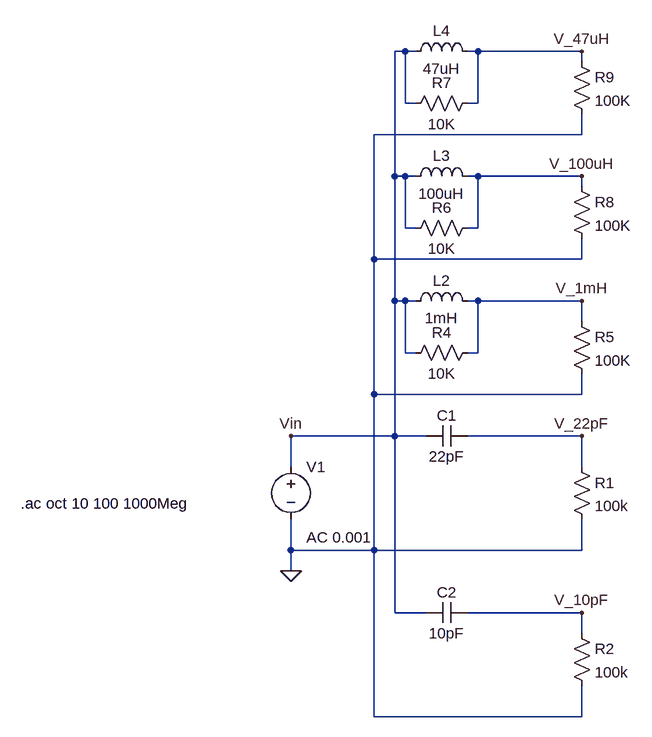
[diagram p0: schematic Filter_003.asc]
Filter_003.asc, the LTspice schematic file:
Version 4
SHEET 1 880 680
WIRE 192 -656 176 -656
WIRE 208 -656 192 -656
WIRE 304 -656 288 -656
WIRE 464 -656 304 -656
WIRE 464 -640 464 -656
WIRE 192 -576 192 -656
WIRE 208 -576 192 -576
WIRE 304 -576 304 -656
WIRE 304 -576 288 -576
WIRE 464 -528 464 -560
WIRE 464 -528 144 -528
WIRE 176 -464 176 -656
WIRE 192 -464 176 -464
WIRE 208 -464 192 -464
WIRE 304 -464 288 -464
WIRE 464 -464 304 -464
WIRE 464 -448 464 -464
WIRE 192 -384 192 -464
WIRE 208 -384 192 -384
WIRE 304 -384 304 -464
WIRE 304 -384 288 -384
WIRE 144 -336 144 -528
WIRE 464 -336 464 -368
WIRE 464 -336 144 -336
WIRE 176 -272 176 -464
WIRE 192 -272 176 -272
WIRE 208 -272 192 -272
WIRE 304 -272 288 -272
WIRE 464 -272 304 -272
WIRE 464 -240 464 -272
WIRE 192 -192 192 -272
WIRE 208 -192 192 -192
WIRE 304 -192 304 -272
WIRE 304 -192 288 -192
WIRE 144 -128 144 -336
WIRE 464 -128 464 -160
WIRE 464 -128 144 -128
WIRE 176 -64 176 -272
WIRE 176 -64 16 -64
WIRE 224 -64 176 -64
WIRE 464 -64 288 -64
WIRE 16 -16 16 -64
WIRE 464 -16 464 -64
WIRE 16 112 16 64
WIRE 144 112 144 -128
WIRE 144 112 16 112
WIRE 464 112 464 64
WIRE 464 112 144 112
WIRE 16 144 16 112
WIRE 176 208 176 -64
WIRE 224 208 176 208
WIRE 464 208 288 208
WIRE 464 240 464 208
WIRE 144 368 144 112
WIRE 464 368 464 320
WIRE 464 368 144 368
FLAG 16 144 0
FLAG 16 -64 Vin
FLAG 464 -64 V_22pF
FLAG 464 208 V_10pF
FLAG 464 -272 V_1mH
FLAG 464 -464 V_100uH
FLAG 464 -656 V_47uH
SYMBOL voltage 16 -32 R0
WINDOW 123 24 124 Left 2
WINDOW 39 0 0 Left 0
SYMATTR Value2 AC 0.001
SYMATTR InstName V1
SYMATTR Value ""
SYMBOL cap 288 192 R90
WINDOW 0 0 32 VBottom 2
WINDOW 3 32 32 VTop 2
SYMATTR InstName C2
SYMATTR Value 10pF
SYMBOL res 448 224 R0
SYMATTR InstName R2
SYMATTR Value 100k
SYMBOL res 448 -32 R0
SYMATTR InstName R1
SYMATTR Value 100k
SYMBOL ind 192 -256 R270
WINDOW 0 32 56 VTop 2
WINDOW 3 5 56 VBottom 2
SYMATTR InstName L2
SYMATTR Value 1mH
SYMATTR SpiceLine Ipk=2 Rser=0.062
SYMBOL res 304 -208 R90
WINDOW 0 0 56 VBottom 2
WINDOW 3 32 56 VTop 2
SYMATTR InstName R4
SYMATTR Value 10K
SYMBOL res 448 -256 R0
SYMATTR InstName R5
SYMATTR Value 100K
SYMBOL ind 192 -448 R270
WINDOW 0 32 56 VTop 2
WINDOW 3 5 56 VBottom 2
SYMATTR InstName L3
SYMATTR Value 100uH
SYMBOL ind 192 -640 R270
WINDOW 0 32 56 VTop 2
WINDOW 3 5 56 VBottom 2
SYMATTR InstName L4
SYMATTR Value 47uH
SYMATTR SpiceLine Ipk=815mA Rser=0.15Ω
SYMBOL res 304 -400 R90
WINDOW 0 0 56 VBottom 2
WINDOW 3 32 56 VTop 2
SYMATTR InstName R6
SYMATTR Value 10K
SYMBOL res 304 -592 R90
WINDOW 0 0 56 VBottom 2
WINDOW 3 32 56 VTop 2
SYMATTR InstName R7
SYMATTR Value 10K
SYMBOL res 448 -464 R0
SYMATTR InstName R8
SYMATTR Value 100K
SYMBOL res 448 -656 R0
SYMATTR InstName R9
SYMATTR Value 100K
SYMBOL cap 288 -80 R90
WINDOW 0 0 32 VBottom 2
WINDOW 3 32 32 VTop 2
SYMATTR InstName C1
SYMATTR Value 22pF
TEXT -400 40 Left 2 !.ac oct 10 100 1000Meg

The netlist it stands for:
* Filter_003.asc
V1 Vin 0 AC 0.001
C2 V_10pF Vin 10pF
R2 V_10pF 0 100k
R1 V_22pF 0 100k
L2 Vin V_1mH 1mH Ipk=2 Rser=0.062
R4 V_1mH Vin 10K
R5 V_1mH 0 100K
L3 Vin V_100uH 100uH
L4 Vin V_47uH 47uH Ipk=815mA Rser=0.15Ω
R6 V_100uH Vin 10K
R7 V_47uH Vin 10K
R8 V_100uH 0 100K
R9 V_47uH 0 100K
C1 V_22pF Vin 22pF
.ac oct 10 100 1000Meg
.backanno
.end

* Results of the author's LTspice run, read from the files saved beside the schematic
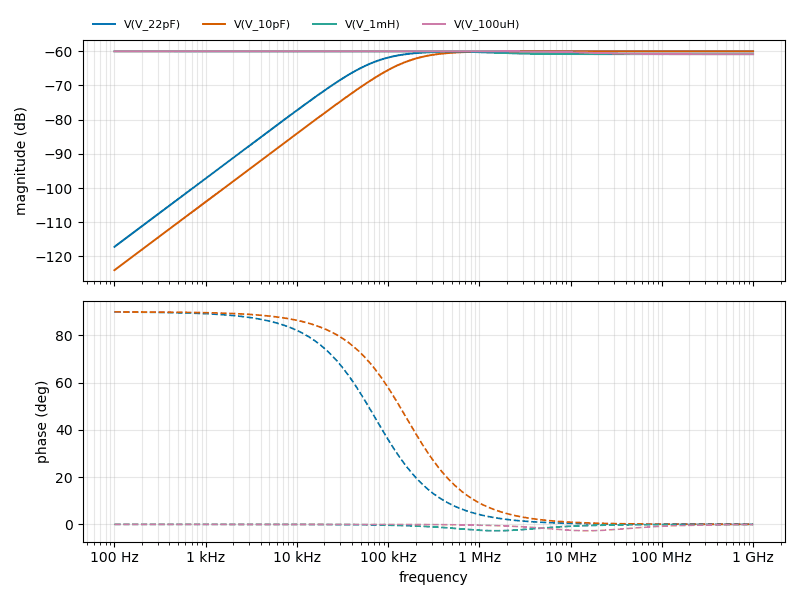
[diagram p1: AC Analysis of Filter_003.asc, plotted from the saved traces]
* AC Analysis, 1 run:
*   V(V_22pF): -117.19 dB at 100 Hz, -60.00 dB at 1 GHz, peak -60.00 dB at 1 GHz, 3 dB below the peak at 72.35 kHz
*   V(V_10pF): -124.04 dB at 100 Hz, -60.00 dB at 1 GHz, peak -60.00 dB at 1 GHz, 3 dB below the peak at 159.2 kHz
*   V(V_1mH): -60.00 dB at 100 Hz, -60.83 dB at 1 GHz, peak -60.00 dB at 100 Hz
*   V(V_100uH): -60.00 dB at 100 Hz, -60.83 dB at 1 GHz, peak -60.00 dB at 100 Hz